# Altium schematic sheet WB-AV-4510-CAN.SchDoc
size A4
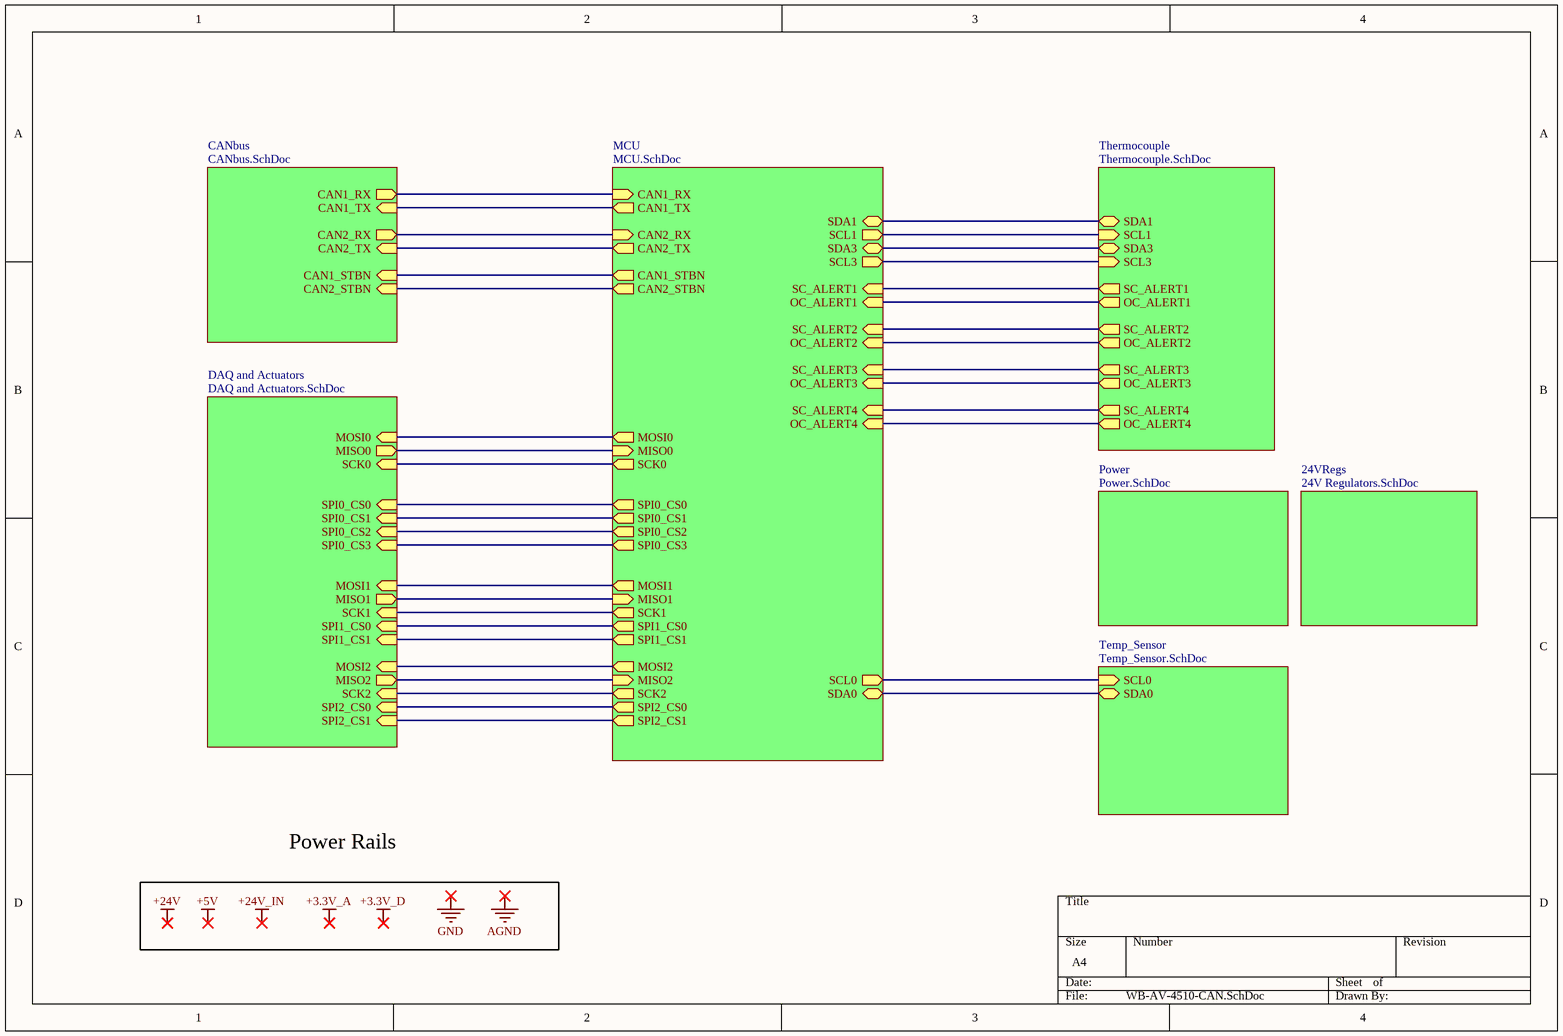
[diagram p0: WB-AV-4510-CAN.SchDoc]

## Sub-sheets
24VRegs = 24V Regulators.SchDoc: no entries
CANbus = CANbus.SchDoc: CAN1_RX (out), CAN1_TX (in), CAN2_RX (out), CAN2_TX (in), CAN1_STBN (in), CAN2_STBN (in)
DAQ and Actuators = DAQ and Actuators.SchDoc: SCK0 (in), MOSI0 (in), SPI0_CS3 (in), MISO0 (out), SPI0_CS2 (in), SPI0_CS0 (in), SPI0_CS1 (in), MOSI2 (in), MISO2 (out), SCK2 (in), SPI2_CS0 (in), SPI2_CS1 (in), MOSI1 (in), MISO1 (out), SCK1 (in), SPI1_CS0 (in), SPI1_CS1 (in)
MCU = MCU.SchDoc: CAN1_RX (in), CAN1_TX (out), CAN2_RX (in), CAN2_TX (out), CAN1_STBN (out), CAN2_STBN (out), MISO0 (in), MOSI0 (out), SCK0 (out), SCL0 (out), SDA0 (bidir), SPI0_CS2 (out), SPI0_CS1 (out), SPI0_CS3 (out), SPI0_CS0 (out), SPI2_CS1 (out), MOSI2 (out), MISO2 (in), SCK2 (out), SPI2_CS0 (out), SDA1 (bidir), SCL1 (out), SDA3 (bidir), SCL3 (out), SC_ALERT1 (in), OC_ALERT1 (in), SC_ALERT2 (in), OC_ALERT2 (in), SC_ALERT3 (in), OC_ALERT3 (in), SC_ALERT4 (in), OC_ALERT4 (in), MOSI1 (out), MISO1 (in), SPI1_CS0 (out), SCK1 (out), SPI1_CS1 (out)
Power = Power.SchDoc: no entries
Temp_Sensor = Temp_Sensor.SchDoc: SCL0 (in), SDA0 (bidir)
Thermocouple = Thermocouple.SchDoc: SCL1 (in), SDA1 (bidir), SDA3 (bidir), SCL3 (in), SC_ALERT1 (out), OC_ALERT1 (out), SC_ALERT2 (out), OC_ALERT2 (out), SC_ALERT3 (out), OC_ALERT3 (out), SC_ALERT4 (out), OC_ALERT4 (out)

## Nets
(unnamed): sheet MCU/CAN1_RX, sheet CANbus/CAN1_RX
(unnamed): sheet MCU/CAN1_TX, sheet CANbus/CAN1_TX
(unnamed): sheet MCU/CAN2_RX, sheet CANbus/CAN2_RX
(unnamed): sheet MCU/CAN2_TX, sheet CANbus/CAN2_TX
(unnamed): sheet MCU/CAN1_STBN, sheet CANbus/CAN1_STBN
(unnamed): sheet MCU/CAN2_STBN, sheet CANbus/CAN2_STBN
(unnamed): sheet MCU/MISO0, sheet DAQ and Actuators/MISO0
(unnamed): sheet MCU/MOSI0, sheet DAQ and Actuators/MOSI0
(unnamed): sheet MCU/SCK0, sheet DAQ and Actuators/SCK0
(unnamed): sheet MCU/SCL0, sheet Temp_Sensor/SCL0
(unnamed): sheet MCU/SDA0, sheet Temp_Sensor/SDA0
(unnamed): sheet MCU/SPI0_CS2, sheet DAQ and Actuators/SPI0_CS2
(unnamed): sheet MCU/SPI0_CS1, sheet DAQ and Actuators/SPI0_CS1
(unnamed): sheet MCU/SPI0_CS3, sheet DAQ and Actuators/SPI0_CS3
(unnamed): sheet MCU/SPI0_CS0, sheet DAQ and Actuators/SPI0_CS0
(unnamed): sheet MCU/SPI2_CS1, sheet DAQ and Actuators/SPI2_CS1
(unnamed): sheet MCU/MOSI2, sheet DAQ and Actuators/MOSI2
(unnamed): sheet MCU/MISO2, sheet DAQ and Actuators/MISO2
(unnamed): sheet MCU/SCK2, sheet DAQ and Actuators/SCK2
(unnamed): sheet MCU/SPI2_CS0, sheet DAQ and Actuators/SPI2_CS0
(unnamed): sheet MCU/SDA1, sheet Thermocouple/SDA1
(unnamed): sheet MCU/SCL1, sheet Thermocouple/SCL1
(unnamed): sheet MCU/SDA3, sheet Thermocouple/SDA3
(unnamed): sheet MCU/SCL3, sheet Thermocouple/SCL3
(unnamed): sheet MCU/SC_ALERT1, sheet Thermocouple/SC_ALERT1
(unnamed): sheet MCU/OC_ALERT1, sheet Thermocouple/OC_ALERT1
(unnamed): sheet MCU/SC_ALERT2, sheet Thermocouple/SC_ALERT2
(unnamed): sheet MCU/OC_ALERT2, sheet Thermocouple/OC_ALERT2
(unnamed): sheet MCU/SC_ALERT3, sheet Thermocouple/SC_ALERT3
(unnamed): sheet MCU/OC_ALERT3, sheet Thermocouple/OC_ALERT3
(unnamed): sheet MCU/SC_ALERT4, sheet Thermocouple/SC_ALERT4
(unnamed): sheet MCU/OC_ALERT4, sheet Thermocouple/OC_ALERT4
(unnamed): sheet MCU/MOSI1, sheet DAQ and Actuators/MOSI1
(unnamed): sheet MCU/MISO1, sheet DAQ and Actuators/MISO1
(unnamed): sheet MCU/SPI1_CS0, sheet DAQ and Actuators/SPI1_CS0
(unnamed): sheet MCU/SCK1, sheet DAQ and Actuators/SCK1
(unnamed): sheet MCU/SPI1_CS1, sheet DAQ and Actuators/SPI1_CS1

## Notes on the sheet
- Power Rails
- Labels drawn without touching a wire or pin: +3.3V_A, +3.3V_D, +5V, +24V, +24V_IN, AGND, GND